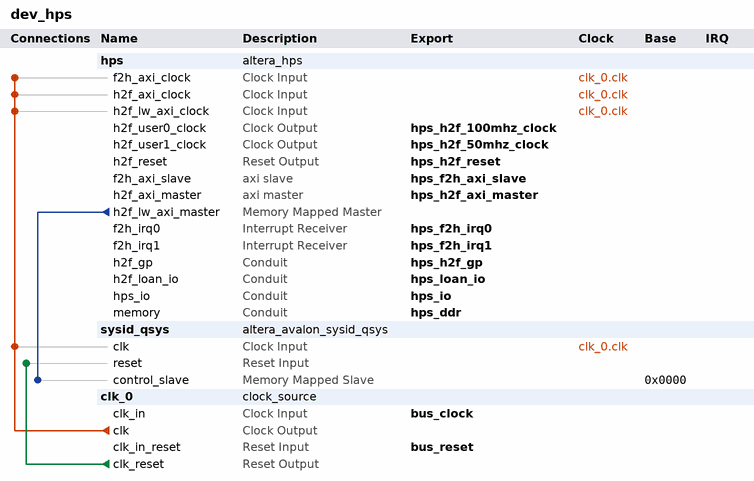
[diagram p0: system contents]
# Platform Designer (Qsys) system dev_hps, Cyclone V 5CSXFC6C6U23C7
# Parameters at their usual value, and those the tool derives, are not listed.
package require -exact qsys 16.1
create_system dev_hps
set_project_property DEVICE_FAMILY {Cyclone V}
set_project_property DEVICE 5CSXFC6C6U23C7

add_instance hps altera_hps 16.1
set_instance_parameter_value hps CAN0_Mode CAN
set_instance_parameter_value hps CAN0_PinMuxing {HPS I/O Set 0}
set_instance_parameter_value hps EMAC1_Mode RGMII
set_instance_parameter_value hps EMAC1_PinMuxing {HPS I/O Set 0}
set_instance_parameter_value hps F2SCLK_COLDRST_Enable false
set_instance_parameter_value hps F2SCLK_DBGRST_Enable false
set_instance_parameter_value hps F2SCLK_WARMRST_Enable false
set_instance_parameter_value hps F2SINTERRUPT_Enable true
set_instance_parameter_value hps F2S_Width 1
set_instance_parameter_value hps FPGA_PERIPHERAL_OUTPUT_CLOCK_FREQ_EMAC0_GTX_CLK 100
set_instance_parameter_value hps FPGA_PERIPHERAL_OUTPUT_CLOCK_FREQ_EMAC0_MD_CLK 100.0
set_instance_parameter_value hps FPGA_PERIPHERAL_OUTPUT_CLOCK_FREQ_EMAC1_GTX_CLK 100
set_instance_parameter_value hps FPGA_PERIPHERAL_OUTPUT_CLOCK_FREQ_EMAC1_MD_CLK 100.0
set_instance_parameter_value hps GP_Enable true
set_instance_parameter_value hps HPS_PROTOCOL DDR3
set_instance_parameter_value hps I2C0_Mode I2C
set_instance_parameter_value hps I2C0_PinMuxing {HPS I/O Set 1}
set_instance_parameter_value hps I2C1_Mode I2C
set_instance_parameter_value hps I2C1_PinMuxing {HPS I/O Set 0}
set_instance_parameter_value hps LWH2F_Enable true
set_instance_parameter_value hps MEM_BANKADDR_WIDTH 3
set_instance_parameter_value hps MEM_CLK_FREQ 400.0
set_instance_parameter_value hps MEM_COL_ADDR_WIDTH 10
set_instance_parameter_value hps MEM_DQ_WIDTH 40
set_instance_parameter_value hps MEM_DRV_STR RZQ/7
set_instance_parameter_value hps MEM_ROW_ADDR_WIDTH 15
set_instance_parameter_value hps MEM_RTT_NOM RZQ/4
set_instance_parameter_value hps MEM_RTT_WR {Dynamic ODT off}
set_instance_parameter_value hps MEM_TCL 7
set_instance_parameter_value hps MEM_TFAW_NS 30.0
set_instance_parameter_value hps MEM_TRAS_NS 35.0
set_instance_parameter_value hps MEM_TRCD_NS 13.75
set_instance_parameter_value hps MEM_TRFC_NS 260.0
set_instance_parameter_value hps MEM_TRP_NS 13.75
set_instance_parameter_value hps MEM_TRRD_NS 10.0
set_instance_parameter_value hps MEM_TRTP_NS 10.0
set_instance_parameter_value hps MEM_VENDOR JEDEC
set_instance_parameter_value hps MEM_VOLTAGE {1.35V DDR3L}
set_instance_parameter_value hps MEM_WTCL 6
set_instance_parameter_value hps QSPI_Mode {2 SS}
set_instance_parameter_value hps QSPI_PinMuxing {HPS I/O Set 1}
set_instance_parameter_value hps REF_CLK_FREQ 25.0
set_instance_parameter_value hps S2FCLK_USER0CLK_Enable true
set_instance_parameter_value hps S2FCLK_USER1CLK_Enable true
set_instance_parameter_value hps S2FCLK_USER1CLK_FREQ 50.0
set_instance_parameter_value hps S2FCLK_USER2CLK 5
set_instance_parameter_value hps S2F_Width 1
set_instance_parameter_value hps SDIO_Mode {4-bit Data}
set_instance_parameter_value hps SDIO_PinMuxing {HPS I/O Set 0}
set_instance_parameter_value hps SPIM1_Mode N/A
set_instance_parameter_value hps SPIM1_PinMuxing Unused
set_instance_parameter_value hps STM_Enable false
set_instance_parameter_value hps TIMING_BOARD_AC_SKEW 0.0
set_instance_parameter_value hps TIMING_BOARD_AC_TO_CK_SKEW 0.0
set_instance_parameter_value hps TIMING_BOARD_DQ_TO_DQS_SKEW 0.0
set_instance_parameter_value hps TIMING_BOARD_MAX_CK_DELAY 0.6
set_instance_parameter_value hps TIMING_BOARD_MAX_DQS_DELAY 0.2
set_instance_parameter_value hps TIMING_BOARD_SKEW_BETWEEN_DQS 0.01
set_instance_parameter_value hps TIMING_BOARD_SKEW_CKDQS_DIMM_MAX 0.215
set_instance_parameter_value hps TIMING_BOARD_SKEW_CKDQS_DIMM_MIN 0.092
set_instance_parameter_value hps TIMING_BOARD_SKEW_WITHIN_DQS 0.0
set_instance_parameter_value hps TIMING_TDH 45
set_instance_parameter_value hps TIMING_TDQSCK 225
set_instance_parameter_value hps TIMING_TDQSQ 100
set_instance_parameter_value hps TIMING_TDQSS 0.27
set_instance_parameter_value hps TIMING_TDS 10
set_instance_parameter_value hps TIMING_TDSH 0.18
set_instance_parameter_value hps TIMING_TDSS 0.18
set_instance_parameter_value hps TIMING_TIH 120
set_instance_parameter_value hps TIMING_TIS 170
set_instance_parameter_value hps TIMING_TQSH 0.4
set_instance_parameter_value hps UART0_Mode {No Flow Control}
set_instance_parameter_value hps UART0_PinMuxing {HPS I/O Set 2}
set_instance_parameter_value hps USB1_Mode SDR
set_instance_parameter_value hps USB1_PinMuxing {HPS I/O Set 0}
set_instance_parameter_value hps desired_cfg_clk_mhz 100.0
set_instance_parameter_value hps desired_qspi_clk_mhz 400.0

add_instance sysid_qsys altera_avalon_sysid_qsys 16.1
set_instance_parameter_value sysid_qsys id 1

add_instance clk_0 clock_source 16.1
set_instance_parameter_value clk_0 clockFrequency 70000000

# connections
add_connection clk_0.clk hps.f2h_axi_clock clock
add_connection clk_0.clk hps.h2f_axi_clock clock
add_connection clk_0.clk hps.h2f_lw_axi_clock clock
add_connection clk_0.clk sysid_qsys.clk clock
add_connection clk_0.clk_reset sysid_qsys.reset reset
add_connection hps.h2f_lw_axi_master sysid_qsys.control_slave avalon
set_connection_parameter_value hps.h2f_lw_axi_master/sysid_qsys.control_slave baseAddress 0x0000

# exported interfaces
add_interface bus_clock clock sink
set_interface_property bus_clock EXPORT_OF clk_0.clk_in
add_interface bus_reset reset sink
set_interface_property bus_reset EXPORT_OF clk_0.clk_in_reset
add_interface hps_ddr conduit end
set_interface_property hps_ddr EXPORT_OF hps.memory
add_interface hps_f2h_axi_slave axi slave
set_interface_property hps_f2h_axi_slave EXPORT_OF hps.f2h_axi_slave
add_interface hps_f2h_irq0 interrupt receiver
set_interface_property hps_f2h_irq0 EXPORT_OF hps.f2h_irq0
add_interface hps_f2h_irq1 interrupt receiver
set_interface_property hps_f2h_irq1 EXPORT_OF hps.f2h_irq1
add_interface hps_h2f_100mhz_clock clock source
set_interface_property hps_h2f_100mhz_clock EXPORT_OF hps.h2f_user0_clock
add_interface hps_h2f_50mhz_clock clock source
set_interface_property hps_h2f_50mhz_clock EXPORT_OF hps.h2f_user1_clock
add_interface hps_h2f_axi_master axi master
set_interface_property hps_h2f_axi_master EXPORT_OF hps.h2f_axi_master
add_interface hps_h2f_gp conduit end
set_interface_property hps_h2f_gp EXPORT_OF hps.h2f_gp
add_interface hps_h2f_reset reset source
set_interface_property hps_h2f_reset EXPORT_OF hps.h2f_reset
add_interface hps_io conduit end
set_interface_property hps_io EXPORT_OF hps.hps_io
add_interface hps_loan_io conduit end
set_interface_property hps_loan_io EXPORT_OF hps.h2f_loan_io

set_interconnect_requirement {$system} qsys_mm.clockCrossingAdapter HANDSHAKE
set_interconnect_requirement {$system} qsys_mm.maxAdditionalLatency 4

save_system dev_hps.qsys
